# EAGLE schematic 210_gpio (EAGLE 7.6.0)
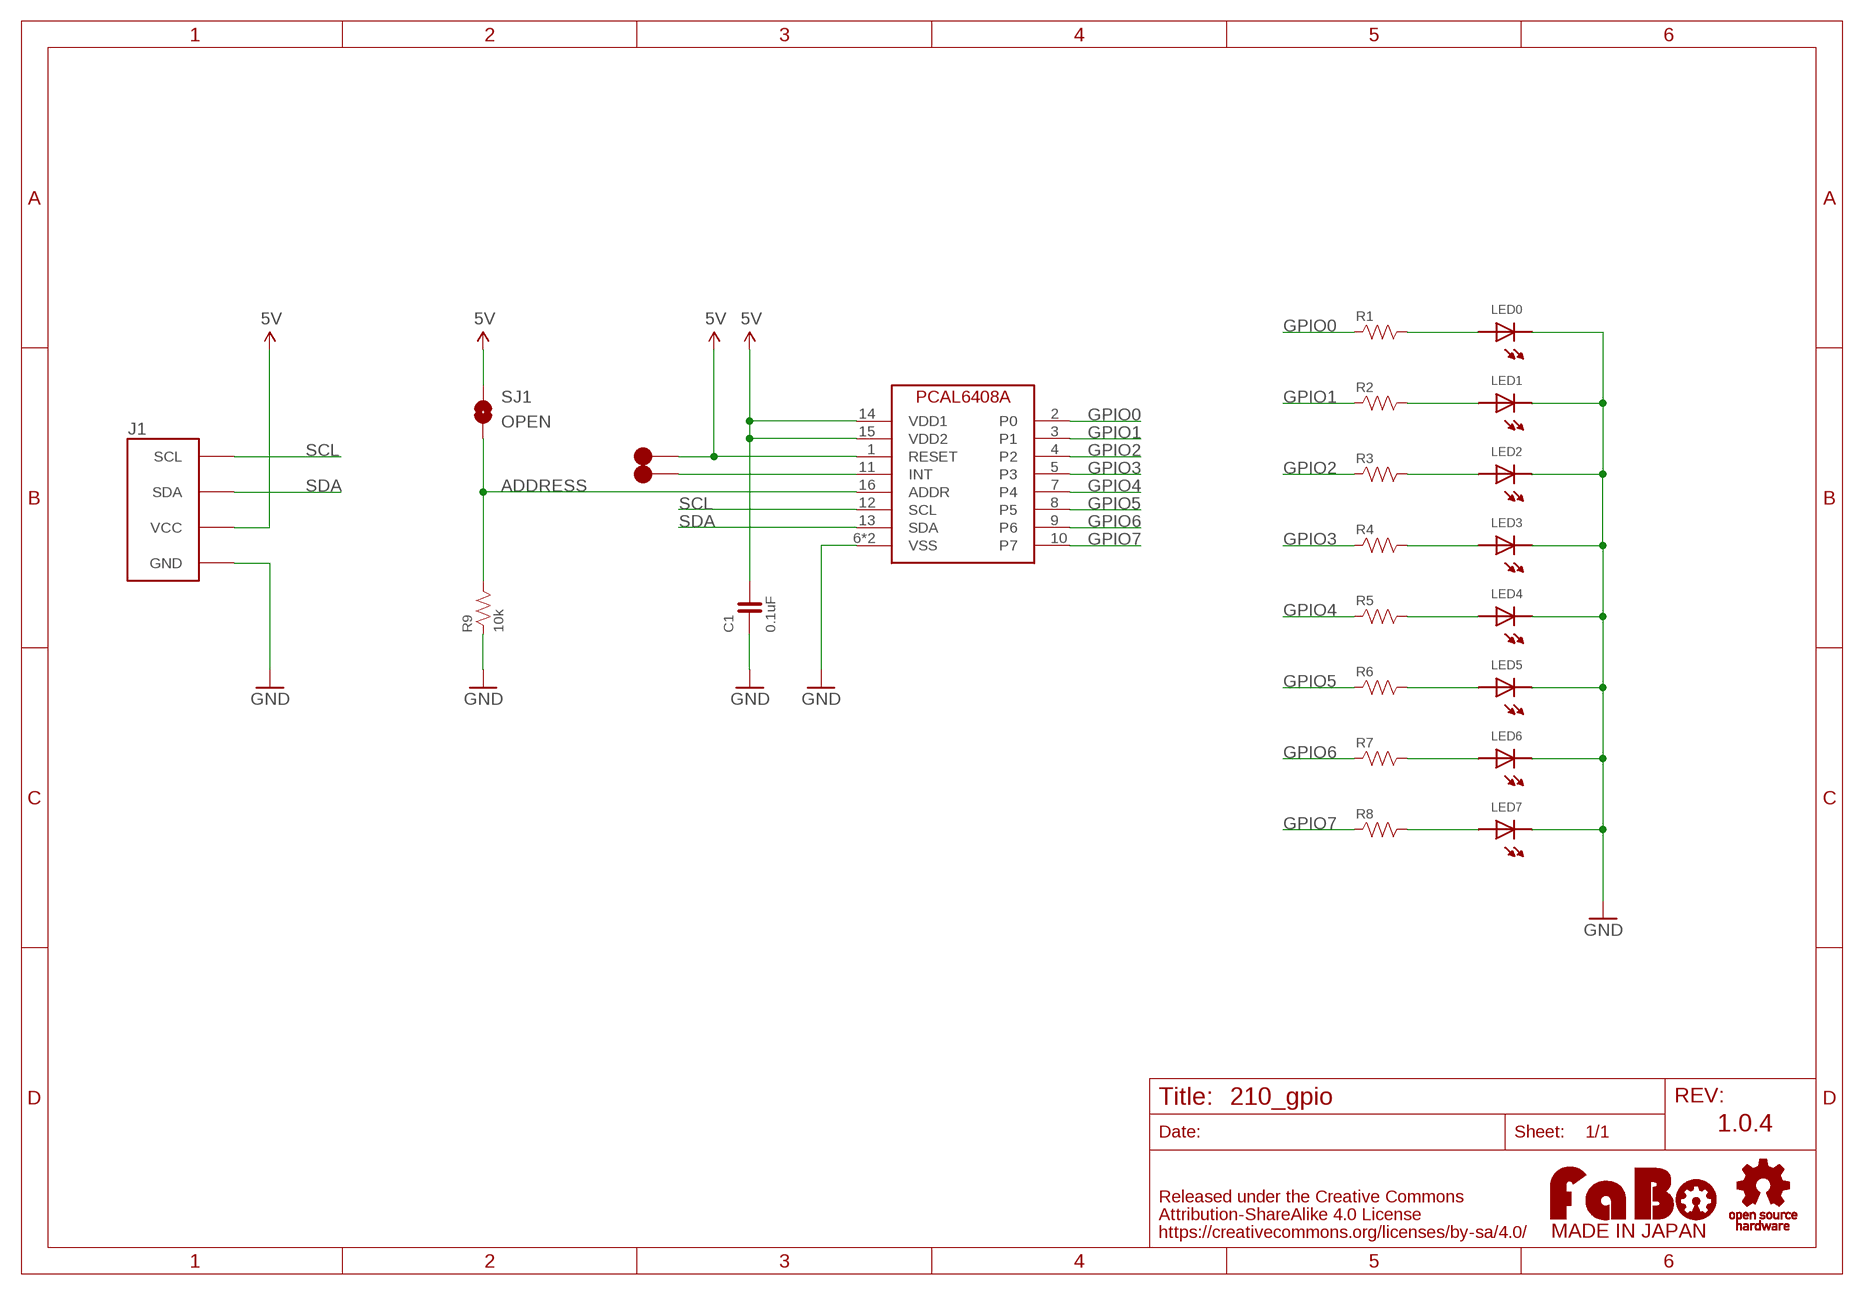
[diagram p0: schematic, sheet 1]

## Parts
C1  0.1uF  CAPACITOR-0603  [0603]
IC1  NX-PCAL6408A  [NXP-PCAL6408A]
J1  FABO_BRICK_I2C  [FABO_BRICK_I2C]
LED0  LED-0603-NARROW  [0603-NARROW]
LED1  LED-0603-NARROW  [0603-NARROW]
LED2  LED-0603-NARROW  [0603-NARROW]
LED3  LED-0603-NARROW  [0603-NARROW]
LED4  LED-0603-NARROW  [0603-NARROW]
LED5  LED-0603-NARROW  [0603-NARROW]
LED6  LED-0603-NARROW  [0603-NARROW]
LED7  LED-0603-NARROW  [0603-NARROW]
R1  RESISTOR-0603-NARROW  [0603-NARROW]
R2  RESISTOR-0603-NARROW  [0603-NARROW]
R3  RESISTOR-0603-NARROW  [0603-NARROW]
R4  RESISTOR-0603-NARROW  [0603-NARROW]
R5  RESISTOR-0603-NARROW  [0603-NARROW]
R6  RESISTOR-0603-NARROW  [0603-NARROW]
R7  RESISTOR-0603-NARROW  [0603-NARROW]
R8  RESISTOR-0603-NARROW  [0603-NARROW]
R9  10k  RESISTOR-0603-NARROW  [0603-NARROW]
SJ1  OPEN  SMD-JUMPER-2-OPEN  [SMD-JUMPER-2-OPEN]
TP1  TP-10  [TP-10]
TP2  TP-10  [TP-10]
U$2  LOGO_OSHW-M_BOTTOM  [LOGO_OSHW_M_BOTTOM]
U$4  LOGO_FABO-M  [LOGO_FABO_MS]

## Nets
5V: C1.2 IC1.1(RESET) IC1.14(VDD1) IC1.15(VDD2) J1.VCC SJ1.1 TP1.1
ADDRESS: IC1.16(ADDR) R9.2 SJ1.2
GND: C1.1 IC1.6(VSS) IC1.17(VSS) J1.GND LED0.CATHODE LED1.CATHODE LED2.CATHODE LED3.CATHODE LED4.CATHODE LED5.CATHODE LED6.CATHODE LED7.CATHODE R9.1
GPIO0: IC1.2(P0) R1.1
GPIO1: IC1.3(P1) R2.1
GPIO2: IC1.4(P2) R3.1
GPIO3: IC1.5(P3) R4.1
GPIO4: IC1.7(P4) R5.1
GPIO5: IC1.8(P5) R6.1
GPIO6: IC1.9(P6) R7.1
GPIO7: IC1.10(P7) R8.1
INT: IC1.11(INT) TP2.1
N$1: LED0.ANODE R1.2
N$2: LED1.ANODE R2.2
N$3: LED2.ANODE R3.2
N$4: LED3.ANODE R4.2
N$5: LED4.ANODE R5.2
N$6: LED5.ANODE R6.2
N$7: LED6.ANODE R7.2
N$8: LED7.ANODE R8.2
SCL: IC1.12(SCL) J1.SCL
SDA: IC1.13(SDA) J1.SDA

## Notes on the sheet
- 1.0.4

## Library data of the parts
C1 = FaBo-Capacitor:CAPACITOR: CAPACITOR
IC1 = FaBo-Mems:NX-PCAL6408A: NXP PCAL6408A
J1 = FaBo-Template:FABO_BRICK_I2C: FaBo Brick I2C
LED0 LED1-LED7 = FaBo-LED:LED
R1-R9 = FaBo-Resistors:RESISTOR: RESISTOR
SJ1 = FaBo-Supply:SMD-JUMPER-2
TP1 TP2 = FaBo-Supply:TP
U$2 = FaBo-etc:LOGO_OSHW
U$4 = FaBo-etc:LOGO_FABO